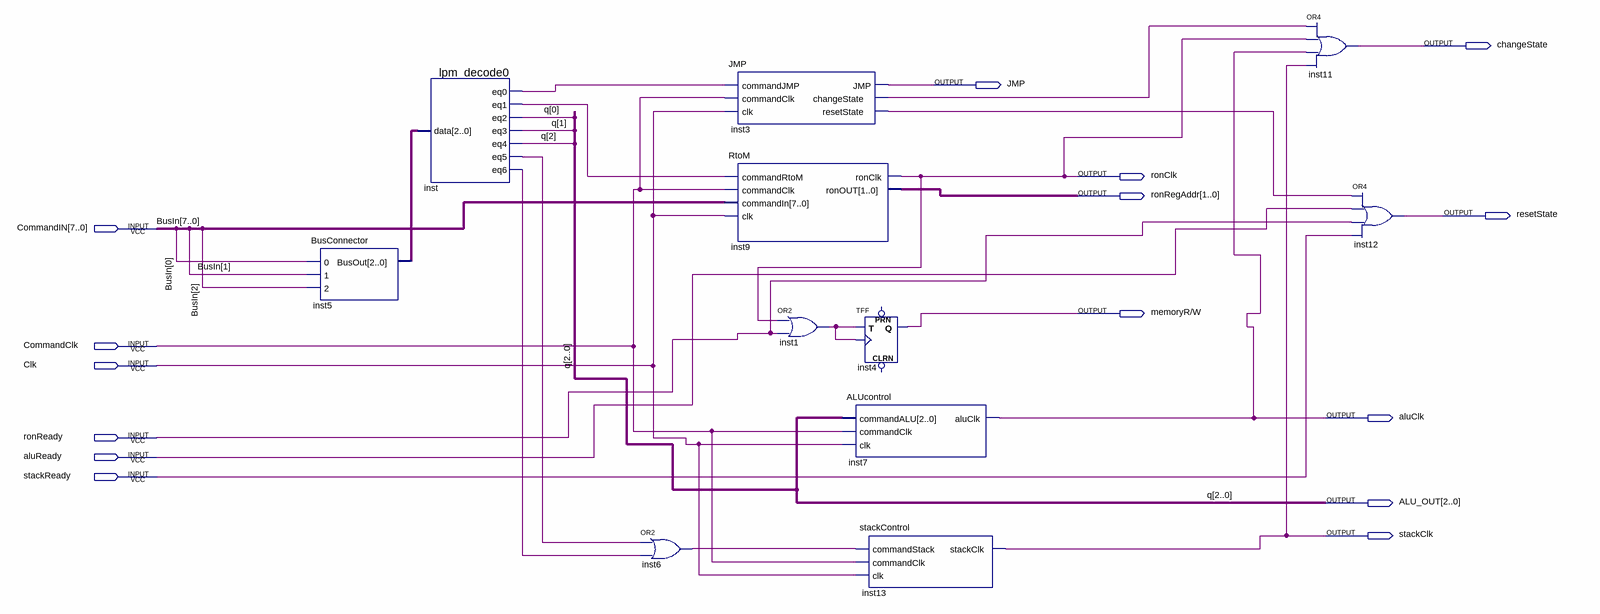
[diagram p0: schematic sheet]
// Quartus schematic CommandDecoder.bdf as structural Verilog: 11 symbols, 15 pins
module CommandDecoder (
  input  [7:0] CommandIN,
  input  CommandClk,
  input  Clk,
  input  ronReady,
  input  aluReady,
  input  stackReady,
  output changeState,
  output JMP,
  output ronClk,
  output [1:0] ronRegAddr,
  output resetState,
  output \memoryR/W ,
  output aluClk,
  output [2:0] ALU_OUT,
  output stackClk
);

  wire inst1_out, inst3_changestate, inst3_resetstate, inst6_out, inst_eq0, inst_eq1, inst_eq5, inst_eq6;
  wire [2:0] inst5_busout;

  BusConnector inst5 (.\0 (CommandIN[0]), .\1 (CommandIN[1]), .\2 (CommandIN[2]), .BusOut(inst5_busout));
  lpm_decode0 inst (
    .data(inst5_busout), .eq0(inst_eq0), .eq1(inst_eq1), .eq2(ALU_OUT[0]), .eq3(ALU_OUT[1]),
    .eq4(ALU_OUT[2]), .eq5(inst_eq5), .eq6(inst_eq6));
  or inst6 (inst6_out, inst_eq5, inst_eq6);
  JMP inst3 (
    .commandJMP(inst_eq0), .commandClk(CommandClk), .clk(Clk), .JMP(JMP), .changeState(inst3_changestate),
    .resetState(inst3_resetstate));
  RtoM inst9 (
    .commandRtoM(inst_eq1), .commandClk(CommandClk), .commandIn(CommandIN), .clk(Clk), .ronClk(ronClk),
    .ronOUT(ronRegAddr));
  or inst1 (inst1_out, ronClk, ronReady);
  TFF inst4 (.T(inst1_out), .CLK(inst1_out), .Q(\memoryR/W ));  // open: PRN, CLRN
  ALUcontrol inst7 (.commandALU(ALU_OUT), .commandClk(CommandClk), .clk(Clk), .aluClk(aluClk));
  stackControl inst13 (.commandStack(inst6_out), .commandClk(CommandClk), .clk(Clk), .stackClk(stackClk));
  or inst11 (changeState, inst3_changestate, ronClk, aluClk, stackClk);
  or inst12 (resetState, inst3_resetstate, aluReady, ronReady, stackReady);

  // Other names for the same wires on the sheet: BusIn[7:0] = CommandIN; q[2:0] = ALU_OUT
endmodule
